# Altium schematic sheet USB_JTAG.SchDoc
size A3
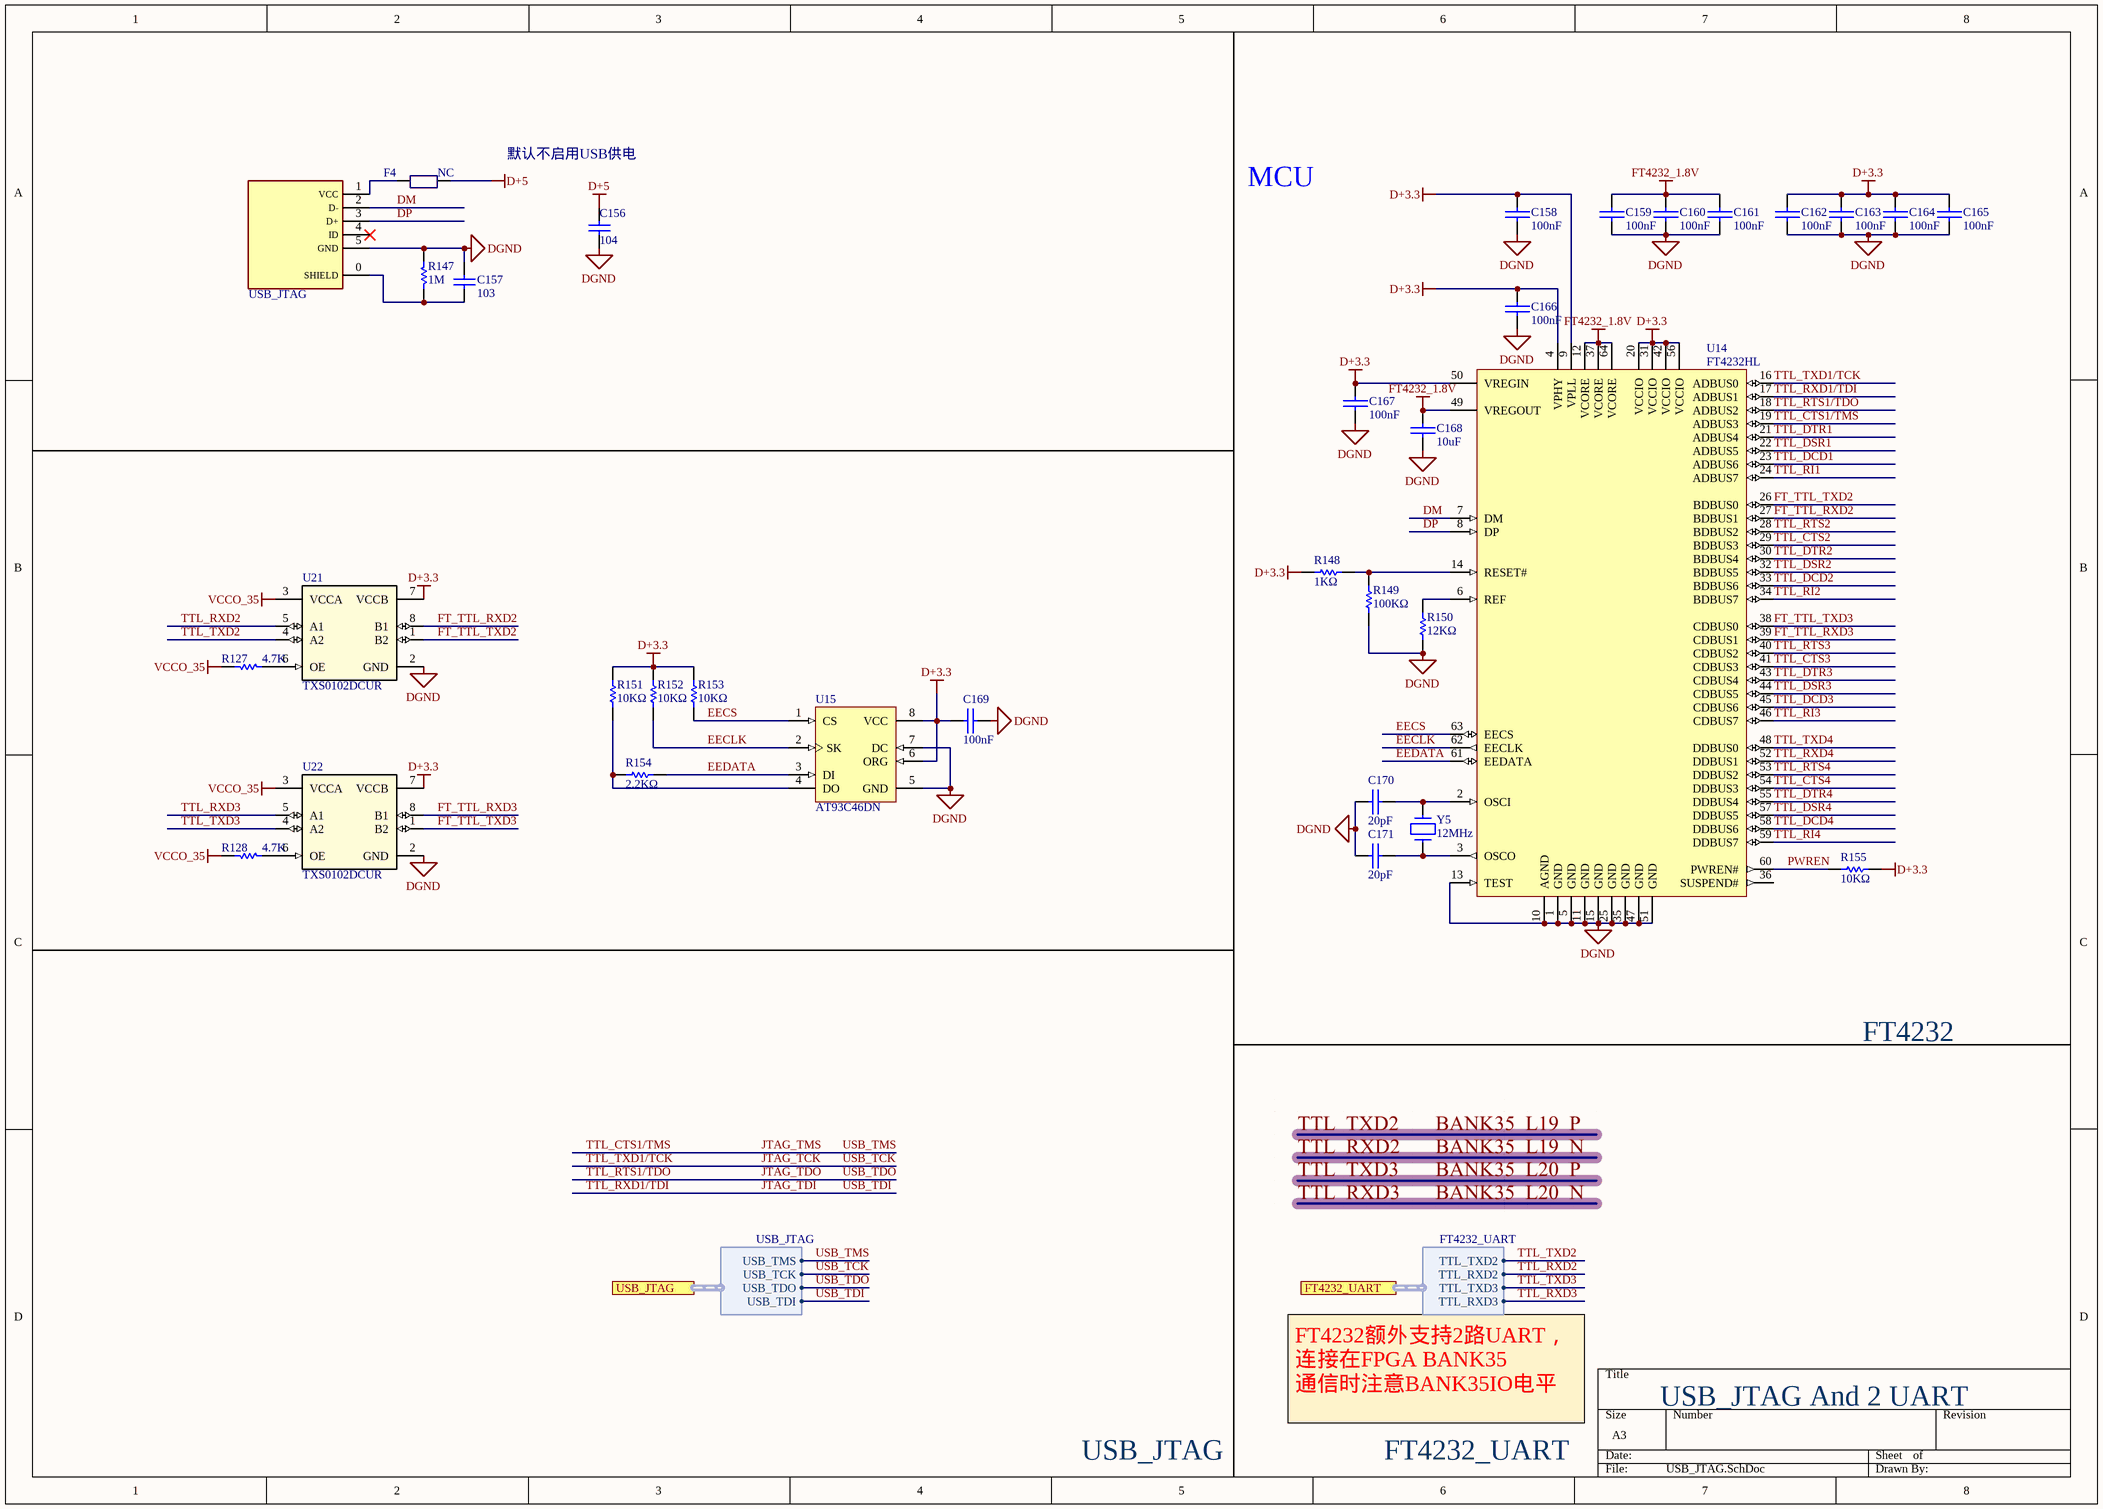
[diagram p0: USB_JTAG.SchDoc]

## Parts
C156  104  [C 0402_LL]
C157  103  [C 0603_L]
C158  100nF  [C 0402_L]
C159  100nF  [C 0402_L]
C160  100nF  [C 0402_L]
C161  100nF  [C 0402_L]
C162  100nF  [C 0402_L]
C163  100nF  [C 0402_L]
C164  100nF  [C 0402_L]
C165  100nF  [C 0402_L]
C166  100nF  [C 0402_L]
C167  100nF  [C 0402_L]
C168  10uF  [C 0603_L]
C169  100nF  [C 0402_L]
C170  20pF  [C 0603_L]
C171  20pF  [C 0603_L]
F4  NC  [FU 0805]
R127  4.7K  [R 0603_L]
R128  4.7K  [R 0603_L]
R147  1M  [R 0603_L]
R148  1KΩ  [R 0603_L]
R149  100KΩ  [R 0603_L]
R150  12KΩ  [R 0603_L]
R151  10KΩ  [R 0603_L]
R152  10KΩ  [R 0603_L]
R153  10KΩ  [R 0603_L]
R154  2.2KΩ  [R 0603_L]
R155  10KΩ  [R 0603_L]
U14  FT4232HL  [LQFP64 10x10_L]
U15  AT93C46DN  [SOP8_L]
U21  TXS0102DCUR  [DCU0008A_N]
U22  TXS0102DCUR  [DCU0008A_N]
USB_JTAG  USB_miniB,microB  [USB-MINI-A]  (value not drawn)
Y5  12MHz  [OSC 5032-2P]

## Ports
FT4232_UART (harness FT4232_UART), USB_JTAG (harness USB_JTAG)

## Harnesses
USB_JTAG: USB_TMS, USB_TCK, USB_TDI, USB_TDO
FT4232_UART: TTL_TXD2, TTL_RXD2, TTL_RXD3, TTL_TXD3

## Nets
D+3.3: C158.2 C162.2 C163.2 C164.2 C165.2 C166.2 C167.2 C169.2 R148.1 R151.2 R152.2 R153.2 R155.2 U14.4(VPHY) U14.9(VPLL) U14.20(VCCIO) U14.31(VCCIO) U14.42(VCCIO) U14.50(VREGIN) U14.56(VCCIO) U15.6(ORG) U15.8(VCC) U21.7(VCCB) U22.7(VCCB)
D+5: C156.2 F4.1
DGND: C156.1 C157.1 C158.1 C159.1 C160.1 C161.1 C162.1 C163.1 C164.1 C165.1 C166.1 C167.1 C168.1 C169.1 C170.1 C171.1 R147.2 R149.1 R150.1 U14.1(GND) U14.5(GND) U14.10(AGND) U14.11(GND) U14.13(TEST) U14.15(GND) U14.25(GND) U14.35(GND) U14.47(GND) U14.51(GND) U15.5(GND) U15.7(DC) U21.2(GND) U22.2(GND) USB_JTAG.5(GND)
FT4232_1.8V: C159.2 C160.2 C161.2 C168.2 U14.12(VCORE) U14.37(VCORE) U14.49(VREGOUT) U14.64(VCORE)
VCCO_35: R127.2 R128.2 U21.3(VCCA) U22.3(VCCA)
DM: U14.7(DM) USB_JTAG.2(D-)
DP: U14.8(DP) USB_JTAG.3(D+)
EECLK: R152.1 U14.62(EECLK) U15.2(SK)
EECS: R153.1 U14.63(EECS) U15.1(CS)
EEDATA: R154.2 U14.61(EEDATA) U15.3(DI)
FT_TTL_RXD2: U14.27(BDBUS1) U21.8(B1)
FT_TTL_RXD3: U14.39(CDBUS1) U22.8(B1)
FT_TTL_TXD2: U14.26(BDBUS0) U21.1(B2)
FT_TTL_TXD3: U14.38(CDBUS0) U22.1(B2)
JTAG_TCK: U14.16(ADBUS0) ; port USB_JTAG.USB_TCK  [also labelled TTL_TXD1/TCK, USB_TCK]
JTAG_TDI: U14.17(ADBUS1) ; port USB_JTAG.USB_TDI  [also labelled TTL_RXD1/TDI, USB_TDI]
JTAG_TDO: U14.18(ADBUS2) ; port USB_JTAG.USB_TDO  [also labelled TTL_RTS1/TDO, USB_TDO]
JTAG_TMS: U14.19(ADBUS3) ; port USB_JTAG.USB_TMS  [also labelled TTL_CTS1/TMS, USB_TMS]
PWREN: R155.1 U14.60(PWREN#)
TTL_CTS2: U14.29(BDBUS3)
TTL_CTS3: U14.41(CDBUS3)
TTL_CTS4: U14.54(DDBUS3)
TTL_DCD1: U14.23(ADBUS6)
TTL_DCD2: U14.33(BDBUS6)
TTL_DCD3: U14.45(CDBUS6)
TTL_DCD4: U14.58(DDBUS6)
TTL_DSR1: U14.22(ADBUS5)
TTL_DSR2: U14.32(BDBUS5)
TTL_DSR3: U14.44(CDBUS5)
TTL_DSR4: U14.57(DDBUS5)
TTL_DTR1: U14.21(ADBUS4)
TTL_DTR2: U14.30(BDBUS4)
TTL_DTR3: U14.43(CDBUS4)
TTL_DTR4: U14.55(DDBUS4)
TTL_RI1: U14.24(ADBUS7)
TTL_RI2: U14.34(BDBUS7)
TTL_RI3: U14.46(CDBUS7)
TTL_RI4: U14.59(DDBUS7)
TTL_RTS2: U14.28(BDBUS2)
TTL_RTS3: U14.40(CDBUS2)
TTL_RTS4: U14.53(DDBUS2)
TTL_RXD2: U21.5(A1) ; port FT4232_UART.TTL_RXD2
TTL_RXD3: U22.5(A1) ; port FT4232_UART.TTL_RXD3
TTL_RXD4: U14.52(DDBUS1)
TTL_TXD2: U21.4(A2) ; port FT4232_UART.TTL_TXD2
TTL_TXD3: U22.4(A2) ; port FT4232_UART.TTL_TXD3
TTL_TXD4: U14.48(DDBUS0)
NetC157_2: C157.2 R147.1 USB_JTAG.0(SHIELD)
NetC170_2: C170.2 U14.2(OSCI) Y5.2
NetC171_2: C171.2 U14.3(OSCO) Y5.1
NetF4_2: F4.2 USB_JTAG.1(VCC)
NetR127_1: R127.1 U21.6(OE)
NetR128_1: R128.1 U22.6(OE)
NetR148_2: R148.2 R149.2 U14.14(RESET#)
NetR150_2: R150.2 U14.6(REF)
NetR151_1: R151.1 R154.1 U15.4(DO)

Not connected (* = marked no-connect by the designer): U14 36(SUSPEND#); USB_JTAG 4(ID)*

## Notes on the sheet
- 默认不启用USB供电
- MCU
- FT4232
- USB_JTAG And 2 UART
- USB_JTAG
- FT4232额外支持2路UART，连接在FPGA BANK35
  通信时注意BANK35IO电平
- FT4232_UART

## Library data of the parts
C156 = Cap: Capacitor; Value: 100pF; Published: 8-Jun-2000; LatestRevisionDate: 17-Jul-2002; LatestRevisionNote: Re-released for DXP Platform.; PackageReference: RAD-0.3; Publisher: Altium Limited; PackageDescription: Radial Cap, Thru-Hole; 2 Leads; 0.3 in Pin Spacing
C157 = Cap: Capacitor; Published: 8-Jun-2000; LatestRevisionDate: 17-Jul-2002; LatestRevisionNote: Re-released for DXP Platform.; PackageReference: RAD-0.3; Publisher: Altium Limited; PackageDescription: Radial Cap, Thru-Hole; 2 Leads; 0.3 in Pin Spacing
C158-C167 C169 = Cap-0603-100nF: 贴片电容; 序号: 686; 规格型号: 100nF ±10%; 最新成本: NC; 存货编码: Cap-0603-100nF; 存货名称: 贴片电容; 产地品牌: NC; value: 100nF
C168 = Cap-0603-10uF: 贴片电容; 序号: 691; 规格型号: 10uF ±10%; 最新成本: NC; 存货编码: Cap-0603-10uF; 存货名称: 贴片电容; 产地品牌: NC; value: 10uF
C170 C171 = Cap-0603-27pF: 贴片电容; 序号: 641; 规格型号: 27pF ±5%; 最新成本: NC; value: 27pF; 存货编码: Cap-0603-27pF; 存货名称: 贴片电容; 产地品牌: NC
F4 = PTC
R127 R128 R147 = Res1: Resistor; Value: 1K; Published: 8-Jun-2000; LatestRevisionDate: 17-Jul-2002; LatestRevisionNote: Re-released for DXP Platform.; PackageReference: AXIAL-0.3; Publisher: Altium Limited; PackageDescription: Axial Device, Thru-Hole; 2 Leads; 0.3 in Pin Spacing
R148 = RES-0603-1K: 贴片电阻; 序号: 245; 规格型号: 1KΩ ±1%; 最新成本: NC; 存货编码: RES-0603-1K; 存货名称: 贴片电阻; 产地品牌: NC; value: 1KΩ
R149 = RES-0603-100K: 贴片电阻; 序号: 292; 规格型号: 100KΩ ±1%; 最新成本: NC; 存货编码: RES-0603-100K; 存货名称: 贴片电阻; 产地品牌: NC; value: 100KΩ
R150 = RES-0603-12K: 贴片电阻; 序号: 270; 规格型号: 12KΩ ±1%; 最新成本: NC; 存货编码: RES-0603-12K; 存货名称: 贴片电阻; 产地品牌: NC; value: 12KΩ
R151-R153 R155 = RES-0603-10K: 贴片电阻; 序号: 268; 规格型号: 10KΩ ±1%; 最新成本: NC; 存货编码: RES-0603-10K; 存货名称: 贴片电阻; 产地品牌: NC; value: 10KΩ
R154 = RES-0603-2.2K: 贴片电阻; 序号: 252; 规格型号: 2.2KΩ ±1%; 最新成本: NC; 存货编码: RES-0603-2.2K; 存货名称: 贴片电阻; 产地品牌: NC; value: 2.2KΩ
U14 = FT4232HL: 序号: 91; 存货名称: IC; 最新成本: NC; 存货编码: FT4232HL; value: FT4232HL; 规格型号: FT4232HL; 产地品牌: NC
U15 = AT93C46DN: 序号: 92; 存货名称: IC; 最新成本: NC; 存货编码: AT93C46DN; value: AT93C46DN; 规格型号: AT93C46DN; 产地品牌: NC
U21 U22 = TXS0102DCUR: No Description Available; Mfr_Name: Texas Instruments; Type: DEV; RefDes: RefDes; Copyright: Copyright (C) 2022 Ultra Librarian. All rights reserved.; Manufacturer_Part_Number: TXS0102DCUR
Y5 = XTAL-49/S_N-12MHz: 晶体; 序号: 838; 最新成本: NC; 存货编码: XTAL-49/S_N-12MHz; 存货名称: 晶体; 规格型号: 12MHz; 产地品牌: NC; value: 12MHz